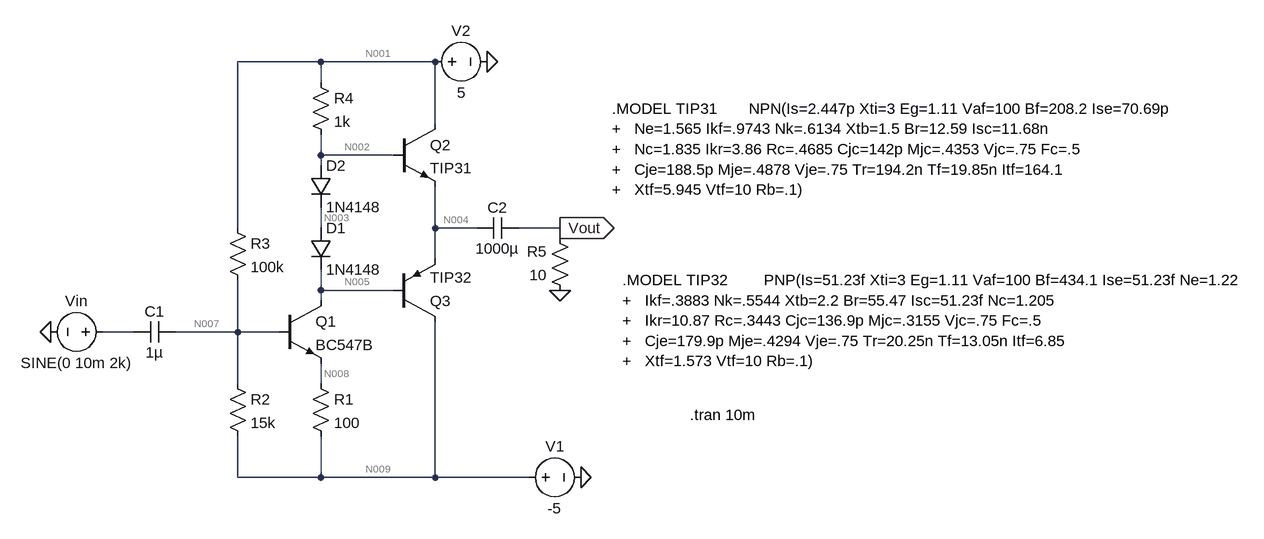
[diagram p0: schematic badpoweramp.asc]
badpoweramp.asc, the LTspice schematic file:
Version 4
SHEET 1 1744 712
WIRE 320 16 192 16
WIRE 496 16 320 16
WIRE 320 48 320 16
WIRE 496 112 496 16
WIRE 320 160 320 128
WIRE 432 160 320 160
WIRE 320 176 320 160
WIRE 192 272 192 16
WIRE 320 272 320 240
WIRE 496 272 496 208
WIRE 560 272 496 272
WIRE 688 272 624 272
WIRE 688 288 688 272
WIRE 496 320 496 272
WIRE 320 368 320 336
WIRE 432 368 320 368
WIRE 320 384 320 368
WIRE 32 432 -16 432
WIRE 192 432 192 352
WIRE 192 432 96 432
WIRE 256 432 192 432
WIRE 192 512 192 432
WIRE 320 512 320 480
WIRE 192 656 192 592
WIRE 320 656 320 592
WIRE 320 656 192 656
WIRE 496 656 496 416
WIRE 496 656 320 656
WIRE 640 656 496 656
FLAG -96 432 0
FLAG 688 368 0
FLAG 688 272 Vout
IOPIN 688 272 Out
FLAG 720 656 0
FLAG 576 16 0
SYMBOL npn 256 384 R0
SYMATTR InstName Q1
SYMATTR Value BC547B
SYMBOL Res 304 496 R0
SYMATTR InstName R1
SYMATTR Value 100
SYMBOL Res 176 496 R0
SYMATTR InstName R2
SYMATTR Value 15k
SYMBOL Cap 96 416 R90
WINDOW 0 0 32 VBottom 2
WINDOW 3 32 32 VTop 2
SYMATTR InstName C1
SYMATTR Value 1µ
SYMBOL Voltage 0 432 R90
WINDOW 0 -32 56 VBottom 2
WINDOW 3 32 56 VTop 2
SYMATTR InstName Vin
SYMATTR Value SINE(0 10m 2k)
SYMBOL Res 176 256 R0
SYMATTR InstName R3
SYMATTR Value 100k
SYMBOL diode 304 272 R0
SYMATTR InstName D1
SYMATTR Value 1N4148
SYMBOL diode 304 176 R0
SYMATTR InstName D2
SYMATTR Value 1N4148
SYMBOL Res 304 32 R0
SYMATTR InstName R4
SYMATTR Value 1k
SYMBOL npn 432 112 R0
SYMATTR InstName Q2
SYMATTR Value TIP31
SYMBOL pnp 432 416 M180
SYMATTR InstName Q3
SYMATTR Value TIP32
SYMBOL Res 704 384 R180
WINDOW 0 36 76 Left 2
WINDOW 3 36 40 Left 2
SYMATTR InstName R5
SYMATTR Value 10
SYMBOL Cap 624 256 R90
WINDOW 0 0 32 VBottom 2
WINDOW 3 32 32 VTop 2
SYMATTR InstName C2
SYMATTR Value 1000µ
SYMBOL Voltage 624 656 R270
WINDOW 0 32 56 VTop 2
WINDOW 3 -32 56 VBottom 2
SYMATTR InstName V1
SYMATTR Value -5
SYMBOL Voltage 480 16 R270
WINDOW 0 32 56 VTop 2
WINDOW 3 -32 56 VBottom 2
SYMATTR InstName V2
SYMATTR Value 5
TEXT 768 88 Left 2 !.MODEL TIP31	   NPN(Is=2.447p Xti=3 Eg=1.11 Vaf=100 Bf=208.2 Ise=70.69p\n+   Ne=1.565 Ikf=.9743 Nk=.6134 Xtb=1.5 Br=12.59 Isc=11.68n\n+   Nc=1.835 Ikr=3.86 Rc=.4685 Cjc=142p Mjc=.4353 Vjc=.75 Fc=.5\n+   Cje=188.5p Mje=.4878 Vje=.75 Tr=194.2n Tf=19.85n Itf=164.1\n+   Xtf=5.945 Vtf=10 Rb=.1)
TEXT 784 352 Left 2 !.MODEL TIP32	    PNP(Is=51.23f Xti=3 Eg=1.11 Vaf=100 Bf=434.1 Ise=51.23f Ne=1.22\n+   Ikf=.3883 Nk=.5544 Xtb=2.2 Br=55.47 Isc=51.23f Nc=1.205\n+   Ikr=10.87 Rc=.3443 Cjc=136.9p Mjc=.3155 Vjc=.75 Fc=.5\n+   Cje=179.9p Mje=.4294 Vje=.75 Tr=20.25n Tf=13.05n Itf=6.85\n+   Xtf=1.573 Vtf=10 Rb=.1)
TEXT 888 560 Left 2 !.tran 10m
LINE Normal 320 516 320 512 2

The netlist it stands for:
* badpoweramp.asc
Q1 N005 N007 N008 0 BC547B
R1 N008 N009 100
R2 N007 N009 15k
C1 N007 N006 1µ
Vin N006 0 SINE(0 10m 2k)
R3 N001 N007 100k
D1 N003 N005 1N4148
D2 N002 N003 1N4148
R4 N001 N002 1k
Q2 N001 N002 N004 0 TIP31
Q3 N009 N005 N004 0 TIP32
R5 0 Vout 10
C2 Vout N004 1000µ
V1 N009 0 -5
V2 N001 0 5
.model D D
.lib standard.dio
.model NPN NPN
.model PNP PNP
.lib standard.bjt
.MODEL TIP31	   NPN(Is=2.447p Xti=3 Eg=1.11 Vaf=100 Bf=208.2 Ise=70.69p
+   Ne=1.565 Ikf=.9743 Nk=.6134 Xtb=1.5 Br=12.59 Isc=11.68n
+   Nc=1.835 Ikr=3.86 Rc=.4685 Cjc=142p Mjc=.4353 Vjc=.75 Fc=.5
+   Cje=188.5p Mje=.4878 Vje=.75 Tr=194.2n Tf=19.85n Itf=164.1
+   Xtf=5.945 Vtf=10 Rb=.1)
.MODEL TIP32	    PNP(Is=51.23f Xti=3 Eg=1.11 Vaf=100 Bf=434.1 Ise=51.23f Ne=1.22
+   Ikf=.3883 Nk=.5544 Xtb=2.2 Br=55.47 Isc=51.23f Nc=1.205
+   Ikr=10.87 Rc=.3443 Cjc=136.9p Mjc=.3155 Vjc=.75 Fc=.5
+   Cje=179.9p Mje=.4294 Vje=.75 Tr=20.25n Tf=13.05n Itf=6.85
+   Xtf=1.573 Vtf=10 Rb=.1)
.tran 10m
.backanno
.end

* Results of the author's LTspice run, read from the files saved beside the schematic
* Operating Point, zero values left out:
*   V(n005) = -648.6 mV
*   V(n007) = -3.889 V
*   V(n008) = -4.567 V
*   V(n009) = -5 V
*   V(n001) = 5 V
*   V(n003) = 977.1 µV
*   V(n002) = 650.6 mV
*   V(n004) = 51.53 mV
*   Ic(Q1) = 4.315 mA
*   Ib(Q1) = 14.83 µA
*   Ie(Q1) = -4.33 mA
*   Ic(Q2) = 28.18 mA
*   Ib(Q2) = 323 µA
*   Ie(Q2) = -28.51 mA
*   Ic(Q3) = -28.22 mA
*   Ib(Q3) = -288.5 µA
*   Ie(Q3) = 28.51 mA
*   I(D1) = 4.026 mA
*   I(D2) = 4.026 mA
*   I(R1) = 4.33 mA
*   I(R2) = 74.06 µA
*   I(R3) = 88.89 µA
*   I(R4) = 4.349 mA
*   I(V1) = 32.62 mA
*   I(V2) = -32.62 mA
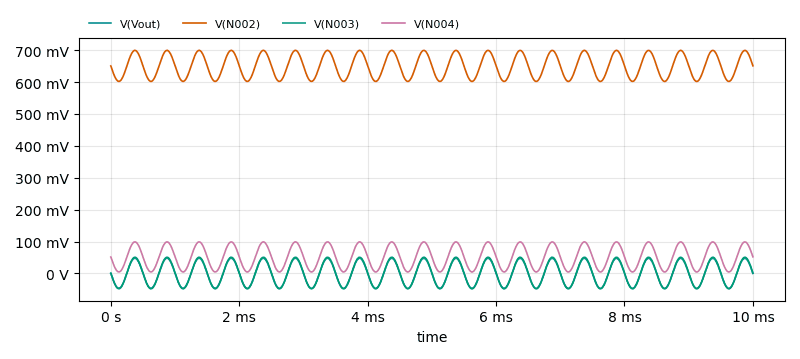
[diagram p1: Transient Analysis of badpoweramp.asc, plotted from the saved traces]
* Transient Analysis, 1 run:
*   V(Vout): min -46.96 mV, max 47.66 mV, average 336.5 µV, rms 33.29 mV, last 67.42 µV
*   V(N002): min 602.1 mV, max 699.5 mV, average 650.8 mV, rms 651.7 mV, last 651 mV
*   V(N003): min -48.26 mV, max 50.68 mV, average 1.185 mV, rms 34.93 mV, last 1.385 mV
*   V(N004): min 4.511 mV, max 98.87 mV, average 51.69 mV, rms 61.49 mV, last 51.93 mV